# Altium schematic sheet Sheet1.SchDoc
size A4
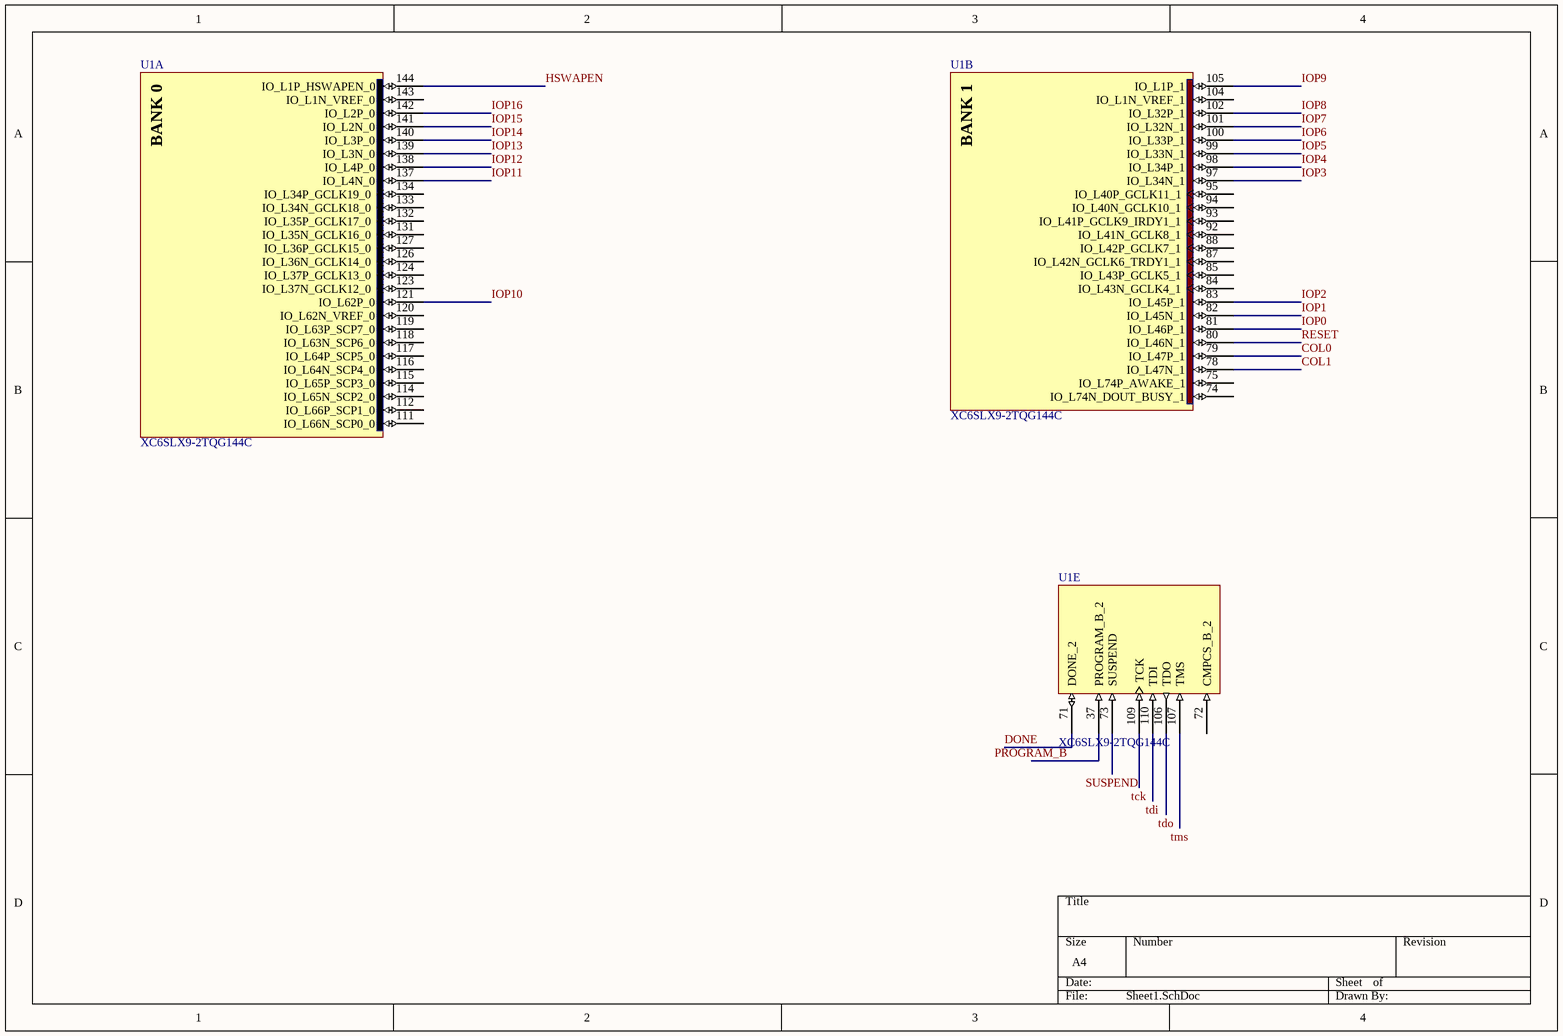
[diagram p0: Sheet1.SchDoc]

## Parts
U1  XC6SLX9-2TQG144C  [TQG144_N]  (parts A,B,E of 7)

## Nets
COL0: U1.79(IO_L47P_1)
COL1: U1.78(IO_L47N_1)
DONE: U1.71(DONE_2)
HSWAPEN: U1.144(IO_L1P_HSWAPEN_0)
IOP0: U1.81(IO_L46P_1)
IOP1: U1.82(IO_L45N_1)
IOP2: U1.83(IO_L45P_1)
IOP3: U1.97(IO_L34N_1)
IOP4: U1.98(IO_L34P_1)
IOP5: U1.99(IO_L33N_1)
IOP6: U1.100(IO_L33P_1)
IOP7: U1.101(IO_L32N_1)
IOP8: U1.102(IO_L32P_1)
IOP9: U1.105(IO_L1P_1)
IOP10: U1.121(IO_L62P_0)
IOP11: U1.137(IO_L4N_0)
IOP12: U1.138(IO_L4P_0)
IOP13: U1.139(IO_L3N_0)
IOP14: U1.140(IO_L3P_0)
IOP15: U1.141(IO_L2N_0)
IOP16: U1.142(IO_L2P_0)
PROGRAM_B: U1.37(PROGRAM_B_2)
RESET: U1.80(IO_L46N_1)
SUSPEND: U1.73(SUSPEND)
tck: U1.109(TCK)
tdi: U1.110(TDI)
tdo: U1.106(TDO)
tms: U1.107(TMS)

Not connected (* = marked no-connect by the designer): U1 72(CMPCS_B_2) 74(IO_L74N_DOUT_BUSY_1) 75(IO_L74P_AWAKE_1) 84(IO_L43N_GCLK4_1) 85(IO_L43P_GCLK5_1) 87(IO_L42N_GCLK6_TRDY1_1) 88(IO_L42P_GCLK7_1) 92(IO_L41N_GCLK8_1) 93(IO_L41P_GCLK9_IRDY1_1) 94(IO_L40N_GCLK10_1) 95(IO_L40P_GCLK11_1) 104(IO_L1N_VREF_1) 111(IO_L66N_SCP0_0) 112(IO_L66P_SCP1_0) 114(IO_L65N_SCP2_0) 115(IO_L65P_SCP3_0) 116(IO_L64N_SCP4_0) 117(IO_L64P_SCP5_0) 118(IO_L63N_SCP6_0) 119(IO_L63P_SCP7_0) 120(IO_L62N_VREF_0) 123(IO_L37N_GCLK12_0) 124(IO_L37P_GCLK13_0) 126(IO_L36N_GCLK14_0) 127(IO_L36P_GCLK15_0) 131(IO_L35N_GCLK16_0) 132(IO_L35P_GCLK17_0) 133(IO_L34N_GCLK18_0) 134(IO_L34P_GCLK19_0) 143(IO_L1N_VREF_0)

## Notes on the sheet
- (in symbol XC6SLX9-2TQG144C, part A) BANK 0
- (in symbol XC6SLX9-2TQG144C, part B) BANK 1

## Library data of the parts
U1 = XC6SLX9-2TQG144C: Spartan-6 LX 1.2V FPGA, 102 User I/Os, 144-Pin TQFP (0.5mm Pitch), Speed Grade 2, Commercial Grade, Pb-Free; DatasheetVersion: ver1.6, Nov-2010; PackageVersion: ver1.2, Jun-2004; PackageReference: TQG144; PackageDescription: 144-Pin Thin Quad Flat Pack (TQG144) - Pb-Free; Code_JEDEC: MS-026-BFB; ComponentLink1Description: Manufacturer URL; ComponentLink1URL: http://www.xilinx.com/; ComponentLink2Description: Spartan-6 Datasheet; ComponentLink2URL: http://www.xilinx.com/support/documentation/data_sheets/ds160.pdf; ComponentLink3Description: Spartan-6 Documents; ComponentLink3URL: http://www.xilinx.com/support/documentation/spartan-6.htm